# EAGLE design RF Test Board (EAGLE 7.7.0)
BOARD_ID: RF_TEST; HW_REV: 1

## Sheet 1 of 3: 3-Switch Configuration
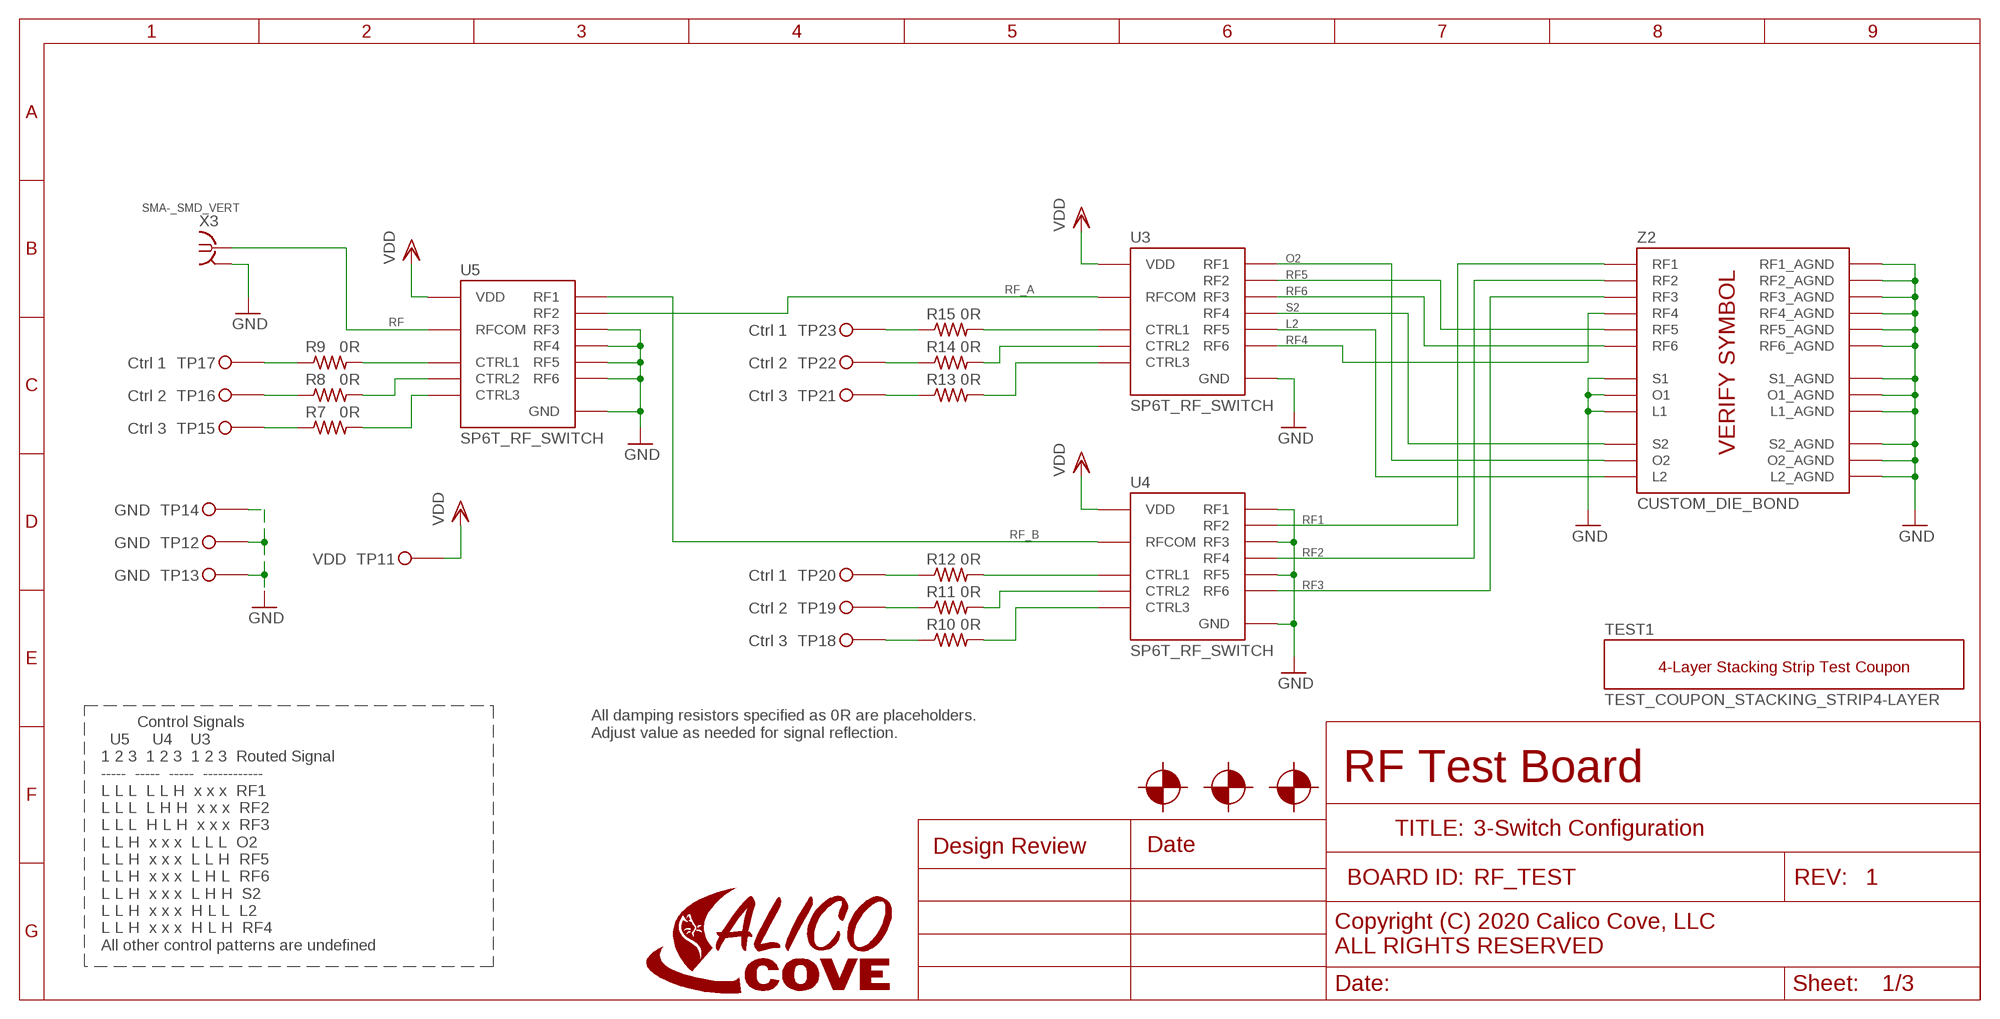
[diagram p0: schematic, sheet 1]

### Parts
DOCBLOCK1  DOCBLOCK_REVIEW_2020  [DOCBLOCK]
FID$1  FIDUCIAL  [FIDUCIAL]
FID$2  FIDUCIAL  [FIDUCIAL]
FID$3  FIDUCIAL  [FIDUCIAL]
LOGO1  LOGO_CC_SMALL  [CC_FULL_SMALL]
R7  0R  RESISTOR0603  [0603]
R8  0R  RESISTOR0603  [0603]
R9  0R  RESISTOR0603  [0603]
R10  0R  RESISTOR0603  [0603]
R11  0R  RESISTOR0603  [0603]
R12  0R  RESISTOR0603  [0603]
R13  0R  RESISTOR0603  [0603]
R14  0R  RESISTOR0603  [0603]
R15  0R  RESISTOR0603  [0603]
TEST1  TEST_COUPON_STACKING_STRIP4-LAYER  [TEST_COUPON_4-LAYER_STACKING_STRIP]
TP11  VDD  TEST_POINT_TH  [TEST_POINT_TH]
TP12  GND  TEST_POINT_TH  [TEST_POINT_TH]
TP13  GND  TEST_POINT_TH  [TEST_POINT_TH]
TP14  GND  TEST_POINT_TH  [TEST_POINT_TH]
TP15  Ctrl 3  TEST_POINT_TH  [TEST_POINT_TH]
TP16  Ctrl 2  TEST_POINT_TH  [TEST_POINT_TH]
TP17  Ctrl 1  TEST_POINT_TH  [TEST_POINT_TH]
TP18  Ctrl 3  TEST_POINT_TH  [TEST_POINT_TH]
TP19  Ctrl 2  TEST_POINT_TH  [TEST_POINT_TH]
TP20  Ctrl 1  TEST_POINT_TH  [TEST_POINT_TH]
TP21  Ctrl 3  TEST_POINT_TH  [TEST_POINT_TH]
TP22  Ctrl 2  TEST_POINT_TH  [TEST_POINT_TH]
TP23  Ctrl 1  TEST_POINT_TH  [TEST_POINT_TH]
U3  SP6T_RF_SWITCH  [MT1817]
U4  SP6T_RF_SWITCH  [MT1817]
U5  SP6T_RF_SWITCH  [MT1817]
X3  SMA-_SMD_VERT  [LINX_SMD]
Z2  CUSTOM_DIE_BOND  [CUSTOM_IC_DIE_BOND]

### Nets
GND: TP12.P$1 TP13.P$1 TP14.P$1 U3.PAD(GND) U3.PAD_VIA(GND) U4.1(RF5) U4.2(RF3) U4.3(RF1) U4.PAD(GND) U4.PAD_VIA(GND) U5.1(RF5) U5.2(RF3) U5.10(RF4) U5.11(RF6) U5.PAD(GND) U5.PAD_VIA(GND) X3.GND1(SHIELD) X3.GND2(SHIELD) Z2.L1 Z2.L1_GND1(L1_AGND) Z2.L1_GND2(L1_AGND) Z2.L2_GND1(L2_AGND) Z2.L2_GND2(L2_AGND) Z2.O1 Z2.O1_GND1(O1_AGND) Z2.O1_GND2(O1_AGND) Z2.O2_GND1(O2_AGND) Z2.O2_GND2(O2_AGND) Z2.RF1_GND1(RF1_AGND) Z2.RF1_GND2(RF1_AGND) Z2.RF2_GND1(RF2_AGND) Z2.RF2_GND2(RF2_AGND) Z2.RF3_GND1(RF3_AGND) Z2.RF3_GND2(RF3_AGND) Z2.RF4_GND1(RF4_AGND) Z2.RF4_GND2(RF4_AGND) Z2.RF5_GND1(RF5_AGND) Z2.RF5_GND2(RF5_AGND) Z2.RF6_GND1(RF6_AGND) Z2.RG6_GND2(RF6_AGND) Z2.S1 Z2.S1_GND1(S1_AGND) Z2.S1_GND2(S1_AGND) Z2.S2_GND1(S2_AGND) Z2.S2_GND2(S2_AGND) ; also sheet 2,3
L2 [RF_50_Ohm_13.3mil]: U3.1(RF5) Z2.L2
N$1: R15.P$1 TP23.P$1
N$2: R14.P$1 TP22.P$1
N$3: R13.P$1 TP21.P$1
N$4: R15.P$2 U3.7(CTRL1)
N$5: R13.P$2 U3.5(CTRL3)
N$6: R14.P$2 U3.6(CTRL2)
N$13: R9.P$1 TP17.P$1
N$14: R8.P$1 TP16.P$1
N$15: R7.P$1 TP15.P$1
N$16: R12.P$1 TP20.P$1
N$17: R11.P$1 TP19.P$1
N$18: R10.P$1 TP18.P$1
N$19: R9.P$2 U5.7(CTRL1)
N$20: R8.P$2 U5.6(CTRL2)
N$21: R7.P$2 U5.5(CTRL3)
N$22: R12.P$2 U4.7(CTRL1)
N$23: R10.P$2 U4.5(CTRL3)
N$24: R11.P$2 U4.6(CTRL2)
O2 [RF_50_Ohm_13.3mil]: U3.3(RF1) Z2.O2
RF [RF_50_Ohm_13.3mil]: U5.13(RFCOM) X3.1
RF1 [RF_50_Ohm_13.3mil]: U4.9(RF2) Z2.RF1
RF2 [RF_50_Ohm_13.3mil]: U4.10(RF4) Z2.RF2
RF3 [RF_50_Ohm_13.3mil]: U4.11(RF6) Z2.RF3
RF4 [RF_50_Ohm_13.3mil]: U3.11(RF6) Z2.RF4
RF5 [RF_50_Ohm_13.3mil]: U3.9(RF2) Z2.RF5
RF6 [RF_50_Ohm_13.3mil]: U3.2(RF3) Z2.RF6
RF_A [RF_50_Ohm_13.3mil]: U3.13(RFCOM) U5.9(RF2)
RF_B [RF_50_Ohm_13.3mil]: U4.13(RFCOM) U5.3(RF1)
S2 [RF_50_Ohm_13.3mil]: U3.10(RF4) Z2.S2
VDD [Power]: TP11.P$1 U3.4(VDD) U4.4(VDD) U5.4(VDD)

### Notes on the sheet
- All damping resistors specified as 0R are placeholders.
  Adjust value as needed for signal reflection.
- 3-Switch Configuration
- Control Signals
    U5     U4    U3
  1 2 3  1 2 3  1 2 3  Routed Signal
  -----  -----  -----  ------------
  L L L  L L H  x x x  RF1
  L L L  L H H  x x x  RF2
  L L L  H L H  x x x  RF3
  L L H  x x x  L L L  O2
  L L H  x x x  L L H  RF5
  L L H  x x x  L H L  RF6
  L L H  x x x  L H H  S2
  L L H  x x x  H L L  L2
  L L H  x x x  H L H  RF4
  All other control patterns are undefined

## Sheet 2 of 3: 2-Switch Configuration
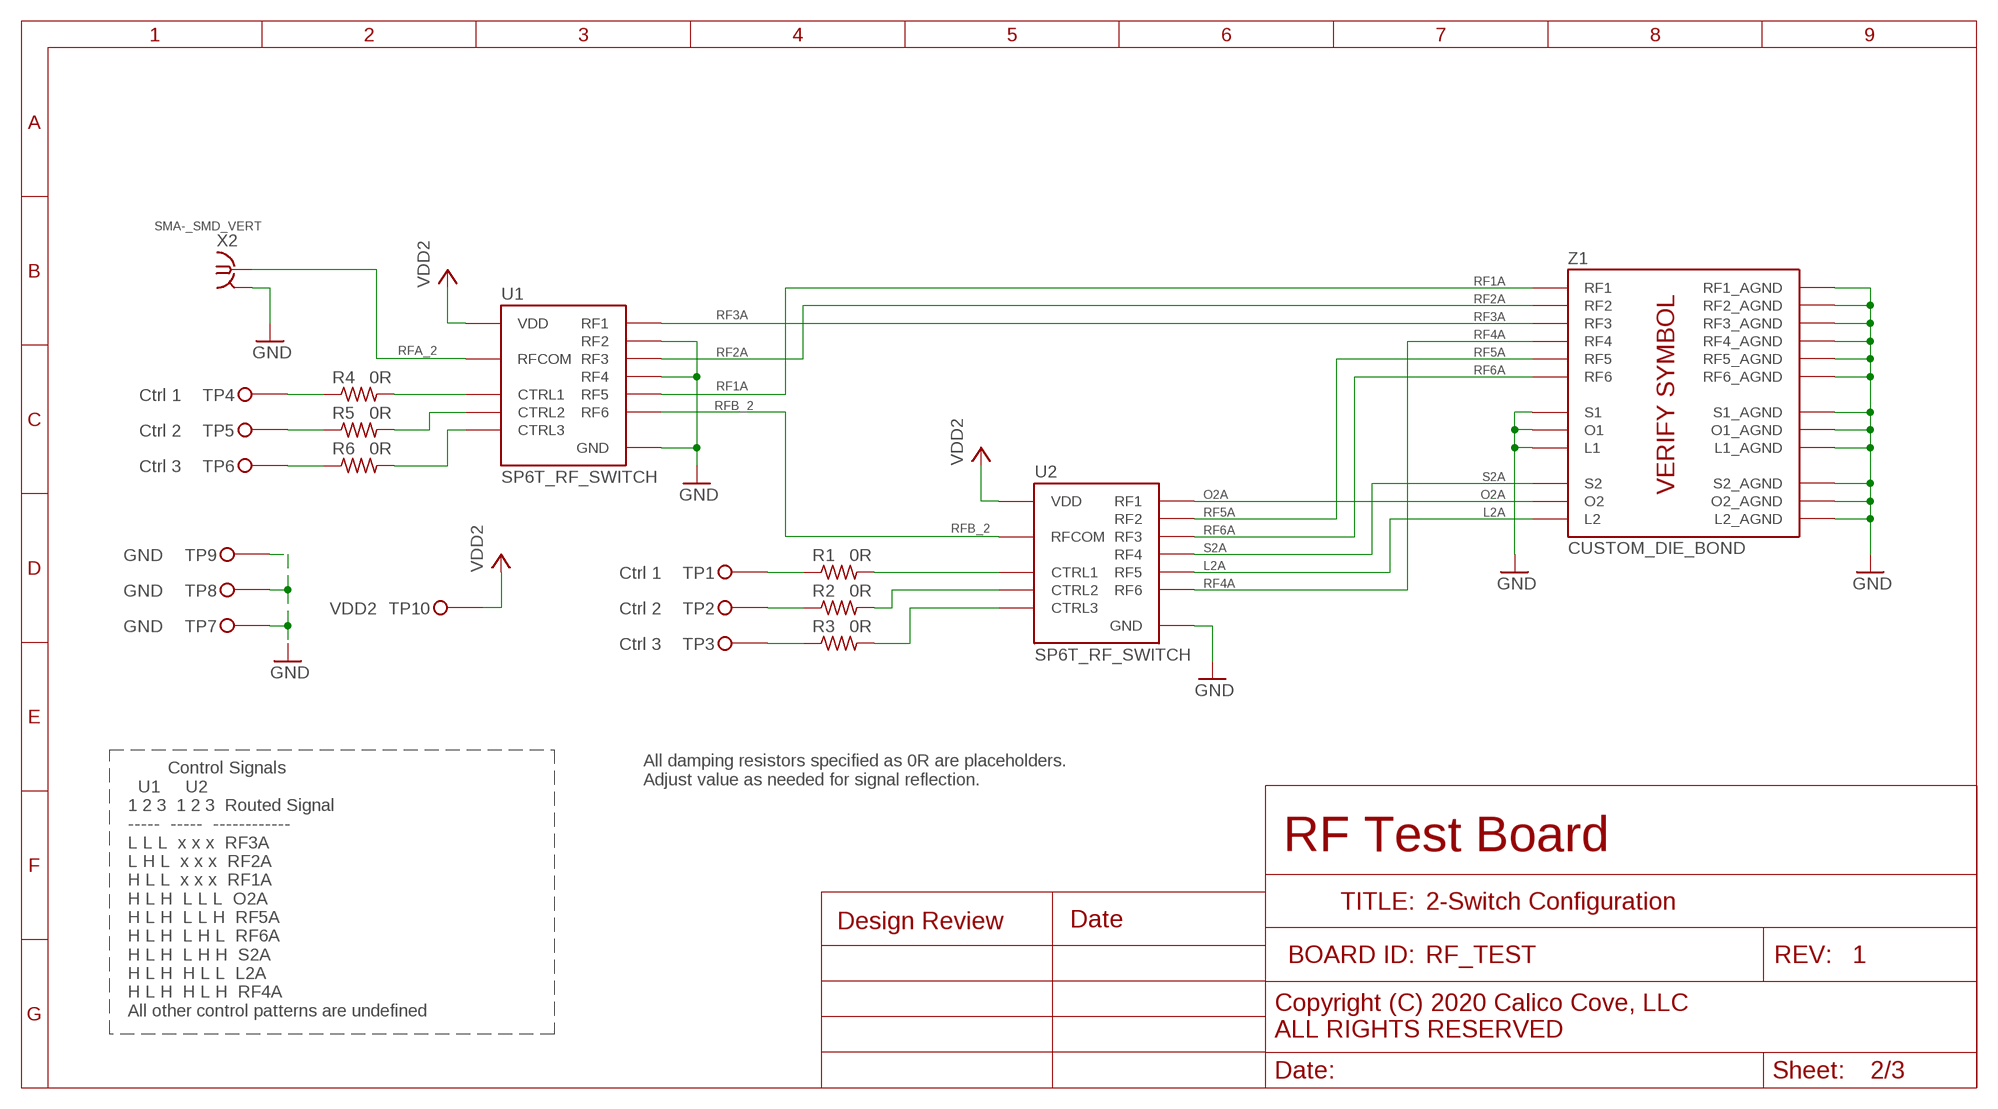
[diagram p1: schematic, sheet 2]

### Parts
R1  0R  RESISTOR0603  [0603]
R2  0R  RESISTOR0603  [0603]
R3  0R  RESISTOR0603  [0603]
R4  0R  RESISTOR0603  [0603]
R5  0R  RESISTOR0603  [0603]
R6  0R  RESISTOR0603  [0603]
TP1  Ctrl 1  TEST_POINT_TH  [TEST_POINT_TH]
TP2  Ctrl 2  TEST_POINT_TH  [TEST_POINT_TH]
TP3  Ctrl 3  TEST_POINT_TH  [TEST_POINT_TH]
TP4  Ctrl 1  TEST_POINT_TH  [TEST_POINT_TH]
TP5  Ctrl 2  TEST_POINT_TH  [TEST_POINT_TH]
TP6  Ctrl 3  TEST_POINT_TH  [TEST_POINT_TH]
TP7  GND  TEST_POINT_TH  [TEST_POINT_TH]
TP8  GND  TEST_POINT_TH  [TEST_POINT_TH]
TP9  GND  TEST_POINT_TH  [TEST_POINT_TH]
TP10  VDD2  TEST_POINT_TH  [TEST_POINT_TH]
U1  SP6T_RF_SWITCH  [MT1817]
U2  SP6T_RF_SWITCH  [MT1817]
X2  SMA-_SMD_VERT  [LINX_SMD]
Z1  CUSTOM_DIE_BOND  [CUSTOM_IC_DIE_BOND]

### Nets
GND: TP7.P$1 TP8.P$1 TP9.P$1 U1.9(RF2) U1.10(RF4) U1.PAD(GND) U1.PAD_VIA(GND) U2.PAD(GND) U2.PAD_VIA(GND) X2.GND1(SHIELD) X2.GND2(SHIELD) Z1.L1 Z1.L1_GND1(L1_AGND) Z1.L1_GND2(L1_AGND) Z1.L2_GND1(L2_AGND) Z1.L2_GND2(L2_AGND) Z1.O1 Z1.O1_GND1(O1_AGND) Z1.O1_GND2(O1_AGND) Z1.O2_GND1(O2_AGND) Z1.O2_GND2(O2_AGND) Z1.RF1_GND1(RF1_AGND) Z1.RF1_GND2(RF1_AGND) Z1.RF2_GND1(RF2_AGND) Z1.RF2_GND2(RF2_AGND) Z1.RF3_GND1(RF3_AGND) Z1.RF3_GND2(RF3_AGND) Z1.RF4_GND1(RF4_AGND) Z1.RF4_GND2(RF4_AGND) Z1.RF5_GND1(RF5_AGND) Z1.RF5_GND2(RF5_AGND) Z1.RF6_GND1(RF6_AGND) Z1.RG6_GND2(RF6_AGND) Z1.S1 Z1.S1_GND1(S1_AGND) Z1.S1_GND2(S1_AGND) Z1.S2_GND1(S2_AGND) Z1.S2_GND2(S2_AGND) ; also sheet 1,3
L2A [RF_50_Ohm_13.3mil]: U2.1(RF5) Z1.L2
N$7: R4.P$1 TP4.P$1
N$9: R5.P$1 TP5.P$1
N$10: R6.P$1 TP6.P$1
N$11: R1.P$1 TP1.P$1
N$12: R2.P$1 TP2.P$1
N$25: R3.P$1 TP3.P$1
N$26: R4.P$2 U1.7(CTRL1)
N$27: R5.P$2 U1.6(CTRL2)
N$28: R6.P$2 U1.5(CTRL3)
N$29: R1.P$2 U2.7(CTRL1)
N$30: R3.P$2 U2.5(CTRL3)
N$31: R2.P$2 U2.6(CTRL2)
O2A [RF_50_Ohm_13.3mil]: U2.3(RF1) Z1.O2
RF1A [RF_50_Ohm_13.3mil]: U1.1(RF5) Z1.RF1
RF2A [RF_50_Ohm_13.3mil]: U1.2(RF3) Z1.RF2
RF3A [RF_50_Ohm_13.3mil]: U1.3(RF1) Z1.RF3
RF4A [RF_50_Ohm_13.3mil]: U2.11(RF6) Z1.RF4
RF5A [RF_50_Ohm_13.3mil]: U2.9(RF2) Z1.RF5
RF6A [RF_50_Ohm_13.3mil]: U2.2(RF3) Z1.RF6
RFA_2 [RF_50_Ohm_13.3mil]: U1.13(RFCOM) X2.1
RFB_2 [RF_50_Ohm_13.3mil]: U1.11(RF6) U2.13(RFCOM)
S2A [RF_50_Ohm_13.3mil]: U2.10(RF4) Z1.S2
VDD2: TP10.P$1 U1.4(VDD) U2.4(VDD)

### Notes on the sheet
- All damping resistors specified as 0R are placeholders.
  Adjust value as needed for signal reflection.
- 2-Switch Configuration
- Control Signals
    U1     U2
  1 2 3  1 2 3  Routed Signal
  -----  -----  ------------
  L L L  x x x  RF3A
  L H L  x x x  RF2A
  H L L  x x x  RF1A
  H L H  L L L  O2A  
  H L H  L L H  RF5A
  H L H  L H L  RF6A
  H L H  L H H  S2A
  H L H  H L L  L2A
  H L H  H L H  RF4A
  All other control patterns are undefined

## Sheet 3 of 3: Test Coupon
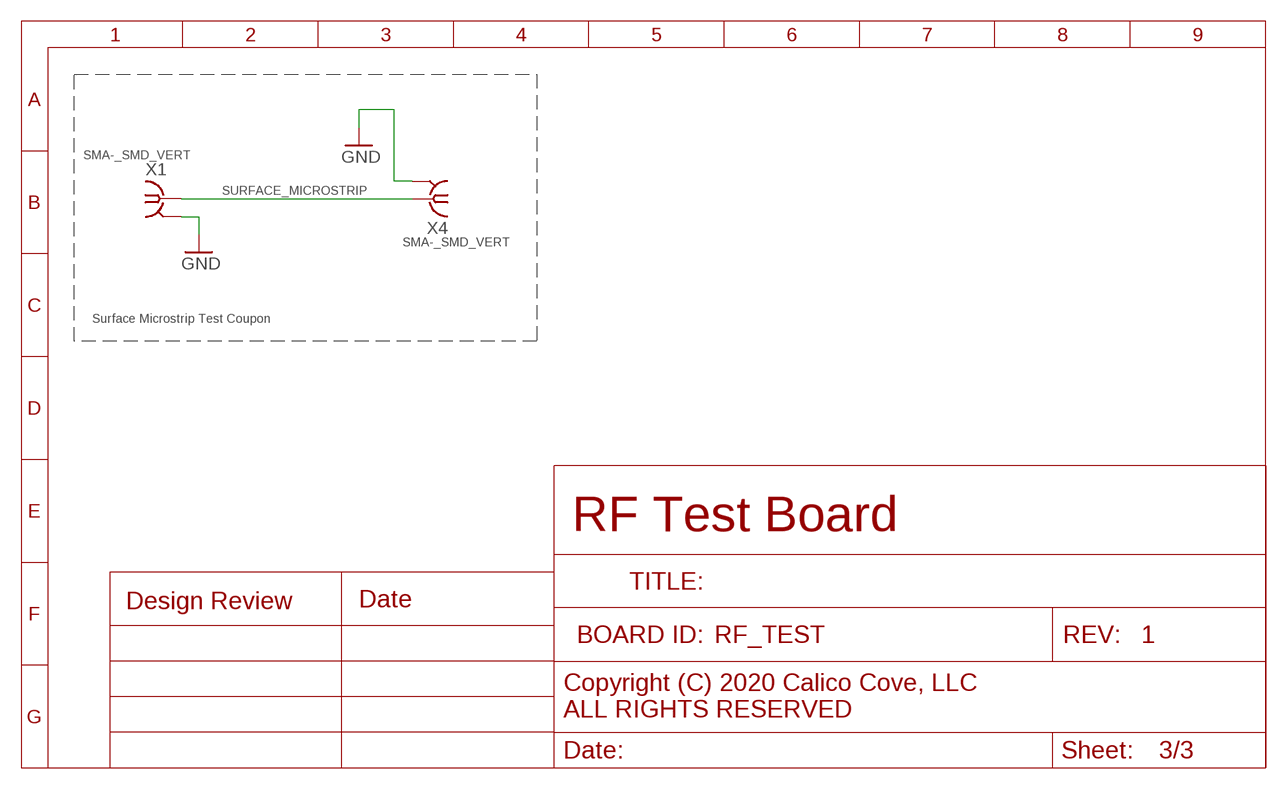
[diagram p2: schematic, sheet 3]

### Parts
X1  SMA-_SMD_VERT  [LINX_SMD]
X4  SMA-_SMD_VERT  [LINX_SMD]

### Nets
GND: X1.GND1(SHIELD) X1.GND2(SHIELD) X4.GND1(SHIELD) X4.GND2(SHIELD) ; also sheet 1,2
SURFACE_MICROSTRIP [RF_50_Ohm_13.3mil]: X1.1 X4.1

### Notes on the sheet
- Surface Microstrip Test Coupon

## Library data of the parts
DOCBLOCK1 = CalicoCove:DOCBLOCK_REVIEW_2020
FID$1-FID$3 = CalicoCove:FIDUCIAL: Fiducial mark on both top and bottom layers
LOGO1 = CalicoCove:LOGO_CC: Various Calico Cove Logos
R1-R15 = Passives:RESISTOR: Resistors; SIZE: 0603
TEST1 = CalicoCove:TEST_COUPON_STACKING_STRIP: Test Coupon for Multilayer Stackup Strips of copper are plotted along one edge of a PCB in such a way that when the PCB is cut from the panel the strips are visible to the naked eye. The strip in each layer gets longer than the one above. This stair step makes it possible to determine that all the layers are in the correct order by simply observing that the stair steps get longer with each layer down into the PCB. It is also possible to examine the overall cross section of the PCB by measuring the thickness of the dielectric layers and the copper layers. This provides a complete audit of the stackup without the need for destructive testing. These features are a part of every PCB, so it is easy to check the cross section and impedance long after the PCB has been assembled, should this be necessary. Ref http://speedingedge.com/PDF-Files/Test Structures.pdf <http://speedingedge.com/PDF-Files/Test%20Structures.pdf>
TP1-TP23 = CalicoCove:TEST_POINT
U1-U5 = RF:SP6T_RF_SWITCH: SP6T RF Switch Reflective RF Switch with internal driver JSW6-33DR+ is a high power 3W reflective SPDT switch with integral driver, operates with single positive supply voltage while consuming, 40 μA typical. It has been designed for very wideband operation of 5-2700 MHz. It is packaged in a tiny 14-lead 2mm x 2mm x 0.55mm package and is rated MSL1 and class 1B ESD.
X1-X4 = RF:SMA-: SMA 50 Ohm Receptacle; DIGIKEY: CONSMA001-SMD-G-ND; MFG: Linx Technologies, Inc.; MPN: CONSMA001-SMD-G
Z1 Z2 = RF:CUSTOM_DIE: Custom DIE Actual Footprint TBD

## Net classes
1 RF_50_Ohm_13.3mil: width 0.338 mm, clearance 0.203 mm

## Board
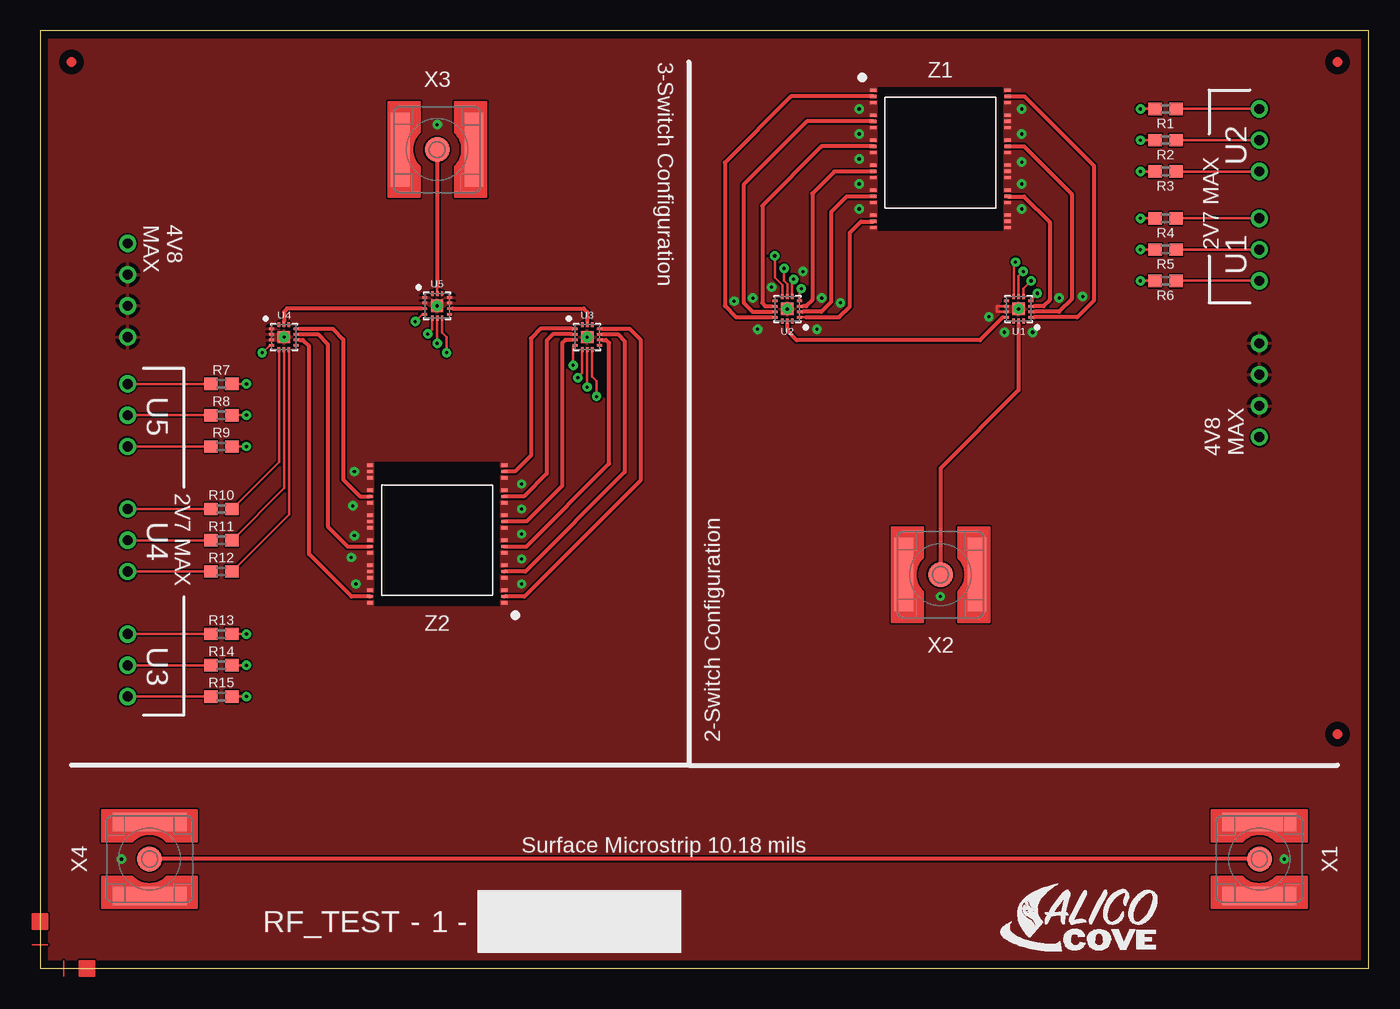
[diagram p3: board, top side]
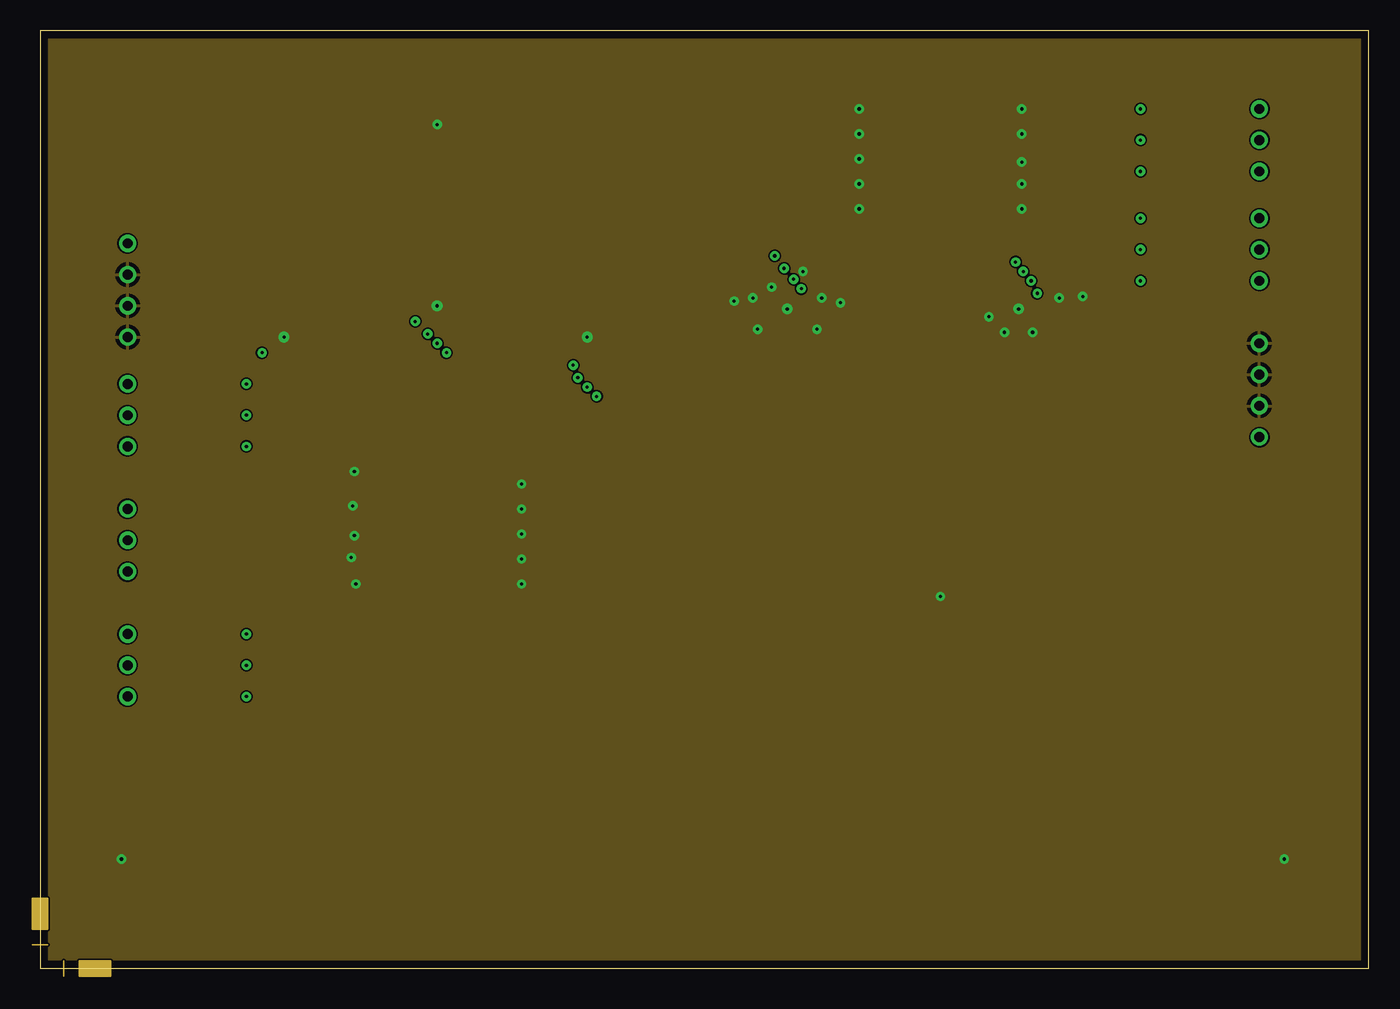
[diagram p4: board, inner layer RF_GND]
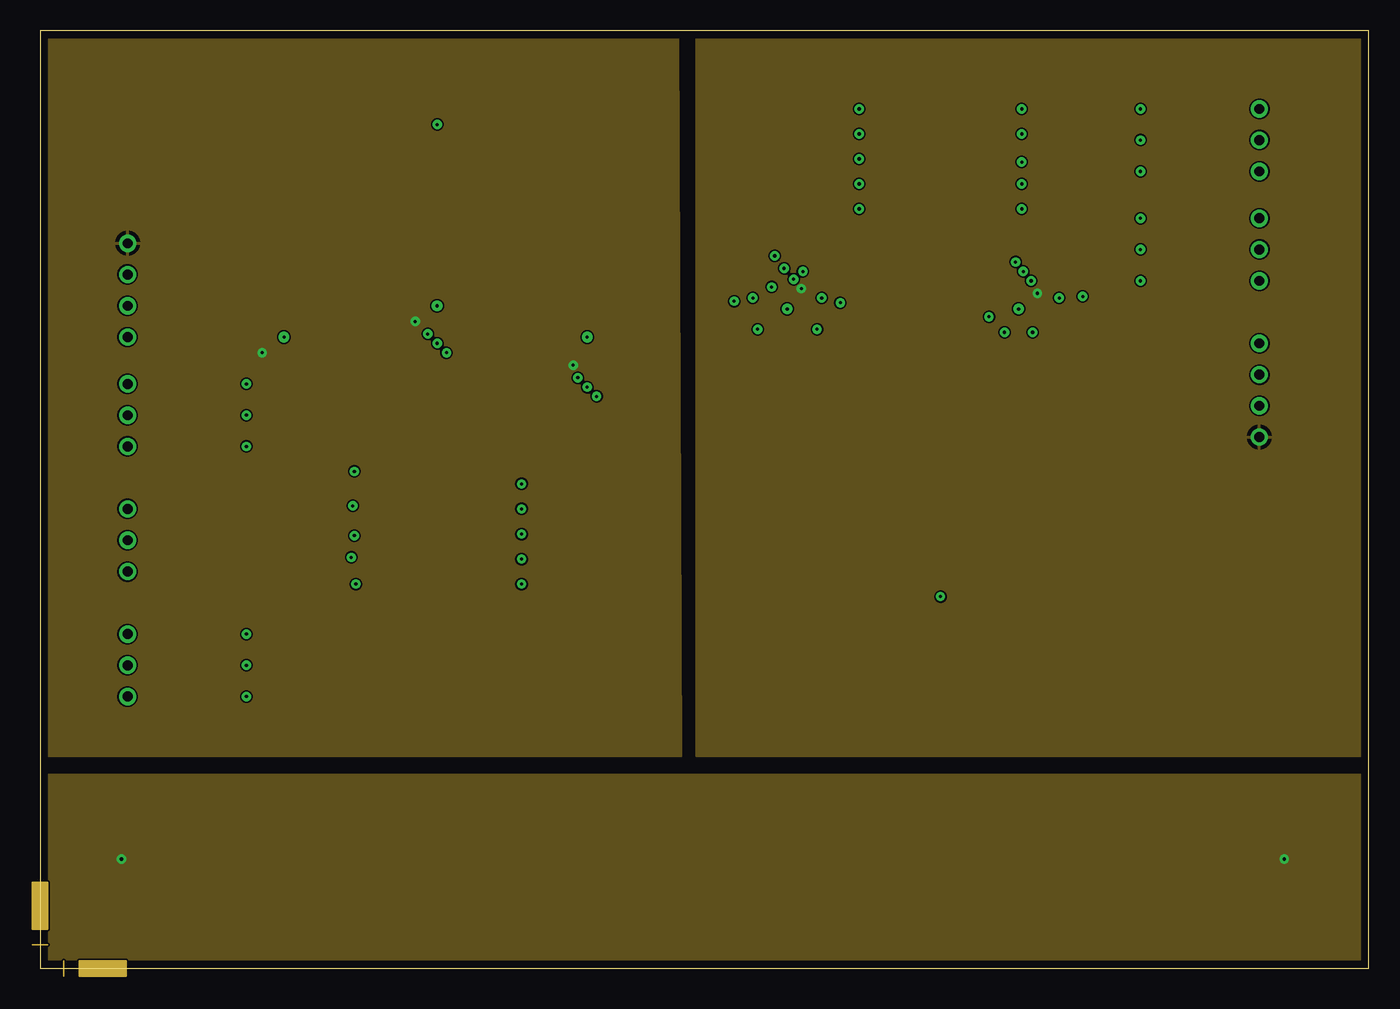
[diagram p5: board, inner layer Power]
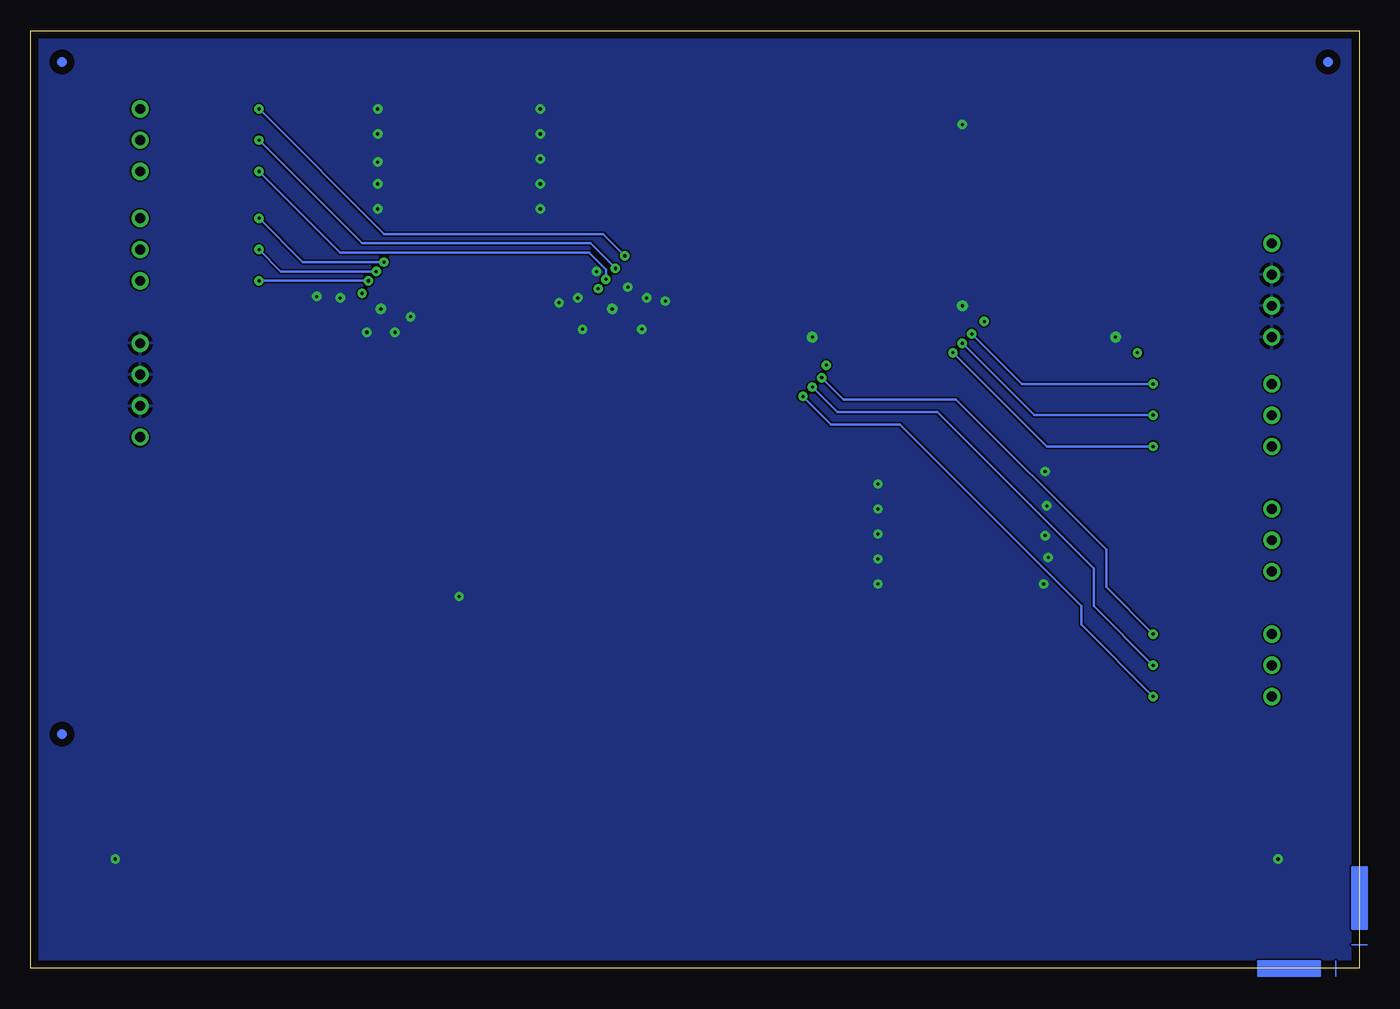
[diagram p6: board, bottom side, seen from below]

Size 107.95 x 76.2 mm. Coordinates in mm from the lower left corner, seen from the top.
Outline: 0,76.2 0,0 107.95,0 107.95,76.2 0,76.2
Copper layers (1*2*15*16): Top 0.053340625mm / dielectric 7.5mil / RF_GND 0.035559375mm / dielectric 40mil / Power 0.035559375mm / dielectric 7.5mil / Bottom 0.053340625mm
Design rules "BAC 4 Layer": minimum track width 5mil, minimum drill 10mil, track to track 5mil, track to pad 7mil, pad to pad 6mil, via to via 6mil, smd to smd 6mil, copper to edge 25mil, drill to drill 15mil, minimum pad ring 12mil, minimum via ring 10mil, stop-mask expansion 3mil, vias tented up to drill 15mil, thermal gap 12mil

### Footprints (pad centres in the part's own frame; a part is rotated, then mirrored left to right if it is on the bottom)
0603 = smd 1.1 x 1: P$1 -0.85,0; P$2 0.85,0
TEST_POINT_TH = drill 0.8: P$1 0,0
MT1817 = smd 0.4 x 0.2: 1 -1,0.675; 2 -1,0.225; 3 -1,-0.225; 4 -1,-0.675; 8 1,-0.675; 9 1,-0.225; 10 1,0.225; 11 1,0.675 | smd 0.2 x 0.4: 5 -0.4,-1; 6 0,-1; 7 0.4,-1; 12 0.4,1; 13 0,1; 14 -0.4,1 | smd 1 x 1: PAD 0,0 | drill 0.254: PAD_VIA 0,0
LINX_SMD = smd 2.05 x 2.05: 1 0,0 | smd 1.5 x 6: GND1 -3,0; GND2 3,0
CUSTOM_IC_DIE_BOND = smd 0.5 x 0.259: L1 5.461,-5.588; L1_GND1 5.461,-6.096; L1_GND2 5.461,-5.08; L2 -5.461,-5.588; L2_GND1 -5.461,-5.08; L2_GND2 -5.461,-6.096; O1 5.461,-1.524; O1_GND1 5.461,-2.032; O1_GND2 5.461,-1.016; O2 -5.461,-1.524; O2_GND1 -5.461,-1.016; O2_GND2 -5.461,-2.032; RF1 5.461,4.572; RF1_GND1 5.461,4.064; RF1_GND2 5.461,5.08; RF2 5.461,0.508; RF2_GND1 5.461,0; RF2_GND2 5.461,1.016; RF3 5.461,-3.556; RF3_GND1 5.461,-4.064; RF3_GND2 5.461,-3.048; RF4 -5.461,4.572; RF4_GND1 -5.461,5.08; RF4_GND2 -5.461,4.064; RF5 -5.461,0.508; RF5_GND1 -5.461,1.016; RF5_GND2 -5.461,0; RF6 -5.461,-3.556; RF6_GND1 -5.461,-3.048; RG6_GND2 -5.461,-4.064; S1 5.461,2.54; S1_GND1 5.461,2.032; S1_GND2 5.461,3.048; S2 -5.461,2.54; S2_GND1 -5.461,3.048; S2_GND2 -5.461,2.032

### Placement (x,y rotation side)
DOCBLOCK1  30.48,3.81 0 top
FID$1  105.41,73.66 270 top
FID$2  105.41,19.05 270 top
FID$3  2.54,73.66 270 top
LOGO1  85.34,3.81 0 top
R1  91.44,69.85 180 top
R2  91.44,67.31 180 top
R3  91.44,64.77 180 top
R4  91.44,60.96 180 top
R5  91.44,58.42 180 top
R6  91.44,55.88 180 top
R7  14.73,47.5 0 top
R8  14.73,44.96 0 top
R9  14.73,42.42 0 top
R10  14.73,37.34 0 top
R11  14.73,34.8 0 top
R12  14.73,32.26 0 top
R13  14.73,27.18 0 top
R14  14.73,24.64 0 top
R15  14.73,22.1 0 top
TEST1  0,0 0 top
TP1  99.06,69.85 0 top
TP2  99.06,67.31 0 top
TP3  99.06,64.77 0 top
TP4  99.06,60.96 0 top
TP5  99.06,58.42 0 top
TP6  99.06,55.88 0 top
TP7  99.06,50.8 0 top
TP8  99.06,48.26 0 top
TP9  99.06,45.72 0 top
TP10  99.06,43.18 0 top
TP11  7.11,58.93 0 top
TP12  7.11,56.39 0 top
TP13  7.11,53.85 0 top
TP14  7.11,51.31 0 top
TP15  7.11,47.5 180 top
TP16  7.11,44.96 180 top
TP17  7.11,42.42 180 top
TP18  7.11,37.34 0 top
TP19  7.11,34.8 0 top
TP20  7.11,32.26 0 top
TP21  7.11,27.18 180 top
TP22  7.11,24.64 0 top
TP23  7.11,22.1 0 top
U1  79.5,53.59 180 top
U2  60.71,53.59 180 top
U3  44.45,51.31 0 top
U4  19.81,51.31 0 top
U5  32.26,53.85 0 top
X1  99.06,8.89 270 top
X2  73.15,32 180 top
X3  32.26,66.55 0 top
X4  8.89,8.89 90 top
Z1  73.15,66.29 0 top
Z2  32.26,34.8 180 top

### Tracks (layer width: path | path; a pad name or v marks a point on that pad's centre or on a via)
GND  (via drill 0.25)
  Top 0.203: U1.10 77.72,53.37 77.72,53.82 78.49,53.82
  other vias: 39.12,39.37 39.12,37.34 39.12,35.31 39.12,33.27 39.12,31.24 25.53,40.39 25.4,37.59 25.53,35.18 25.27,33.4 25.65,31.24 6.6,8.89 101.09,8.89 66.55,61.72 66.55,63.75 66.55,65.79 66.55,67.82 66.55,69.85 79.76,69.85 79.76,67.82 79.76,65.53 79.76,63.75 79.76,61.72 32.26,68.58 73.15,30.23 65.02,54.1 63.5,54.48 57.91,54.48 56.39,54.23 58.29,51.94 63.12,51.94 77.09,52.96 78.36,51.69 80.64,51.69 84.71,54.61 82.8,54.48 61.98,56.64 59.44,55.37
  pour Top (rank 6): 0,76.2 107.95,76.2 107.95,0 0,0
  pour Top (no thermals): 38.35,41.66 26.16,41.66 26.16,28.96 38.35,28.96
  pour Bottom (rank 6): 0,76.2 107.95,76.2 107.95,0 0,0
  pour RF_GND (rank 6): 0,0 0,76.2 107.95,76.2 107.95,0
  pour Top (no thermals): 79.25,72.14 67.06,72.14 67.06,59.44 79.25,59.44
  pour Power: 0,0 0,15.75 107.95,15.75 107.95,0
L2
  Top 0.203: U3.1 43.22,51.98
  Top 0.338: Z2.L2 38.58,40.39 39.88,41.68 39.88,51.2 40.66,51.98 43.22,51.98
L2A
  Top 0.203: U2.1 62.23,52.92
  Top 0.338: Z1.L2 66.7,60.71 65.79,59.79 65.79,53.79 64.92,52.92 62.23,52.92
N$1
  Top 0.203: TP23.P$1 R15.P$1
N$2
  Top 0.203: TP22.P$1 R14.P$1
N$3
  Top 0.203: TP21.P$1 R13.P$1
N$4  (via drill 0.25)
  Top 0.203: U3.7 44.85,48.11 45.21,47.75 v45.21,46.48 | R15.P$2 v16.76,22.1
  Bottom 0.203: v45.21,46.48 42.93,44.2 37.34,44.2 22.61,29.46 22.61,27.94 v16.76,22.1
N$5  (via drill 0.25)
  Top 0.203: U3.5 44.05,48.37 v43.69,48.01 | R13.P$2 v16.76,27.18
  Bottom 0.203: v43.69,48.01 41.91,46.23 32.77,46.23 20.57,34.04 20.57,30.99 v16.76,27.18
N$6  (via drill 0.25)
  Top 0.203: U3.6 v44.45,47.24 | R14.P$2 v16.76,24.64
  Bottom 0.203: v44.45,47.24 42.42,45.21 34.29,45.21 21.59,32.51 21.59,29.46 v16.76,24.64
N$7
  Top 0.203: R4.P$1 TP4.P$1
N$9
  Top 0.203: R5.P$1 TP5.P$1
N$10
  Top 0.203: R6.P$1 TP6.P$1
N$11
  Top 0.203: R1.P$1 TP1.P$1
N$12
  Top 0.203: R2.P$1 TP2.P$1
N$13
  Top 0.203: TP17.P$1 R9.P$1
N$14
  Top 0.203: TP16.P$1 R8.P$1
N$15
  Top 0.203: TP15.P$1 R7.P$1
N$16
  Top 0.203: TP20.P$1 R12.P$1
N$17
  Top 0.203: TP19.P$1 R11.P$1
N$18
  Top 0.203: TP18.P$1 R10.P$1
N$19  (via drill 0.25)
  Top 0.203: U5.7 32.66,51.67 33.02,51.31 v33.02,50.04 | v16.76,42.42 R9.P$2
  Bottom 0.203: v16.76,42.42 25.4,42.42 v33.02,50.04
N$20  (via drill 0.25)
  Top 0.203: U5.6 v32.26,50.8 | v16.76,44.96 R8.P$2
  Bottom 0.203: v32.26,50.8 26.42,44.96 v16.76,44.96
N$21  (via drill 0.25)
  Top 0.203: U5.5 31.86,51.92 v31.5,51.56 | v16.76,47.5 R7.P$2
  Bottom 0.203: v31.5,51.56 27.43,47.5 v16.76,47.5
N$22
  Top 0.203: R12.P$2 20.21,36.89 U4.7
N$23
  Top 0.203: R10.P$2 19.41,41.17 U4.5
N$24
  Top 0.203: R11.P$2 19.81,39.03 U4.6
N$25
  Top 0.203: R3.P$1 TP3.P$1
N$26  (via drill 0.25)
  Top 0.203: U1.7 79.1,57.26 v79.25,57.4 | R4.P$2 v89.41,60.96
  Bottom 0.203: v79.25,57.4 85.85,57.4 v89.41,60.96
N$27  (via drill 0.25)
  Top 0.203: U1.6 79.5,56.26 v79.88,56.64 | R5.P$2 v89.41,58.42
  Bottom 0.203: v79.88,56.64 85.34,56.64 86.61,56.64 87.63,56.64 v89.41,58.42
N$28  (via drill 0.25)
  Top 0.203: U1.5 79.9,55.26 v80.52,55.88 | R6.P$2 v89.41,55.88
  Bottom 0.203: v80.52,55.88 86.36,55.88 86.87,55.88 v89.41,55.88
N$29  (via drill 0.25)
  Top 0.203: U2.7 60.31,55.52 59.69,56.13 v59.69,57.91 | R1.P$2 v89.41,69.85
  Bottom 0.203: v59.69,57.91 61.47,59.69 79.25,59.69 v89.41,69.85
N$30  (via drill 0.25)
  Top 0.203: U2.5 61.11,55.9 v61.21,56.01 | R3.P$2 v89.41,64.77
  Bottom 0.203: v61.21,56.01 61.21,56.8 62.58,58.17 82.8,58.17 v89.41,64.77
N$31  (via drill 0.25)
  Top 0.203: U2.6 60.71,55.63 60.45,55.88 v60.45,56.9 | R2.P$2 v89.41,67.31
  Bottom 0.203: v60.45,56.9 62.48,58.93 81.03,58.93 v89.41,67.31
O2
  Top 0.203: U3.3 43.21,51.08
  Top 0.338: Z2.O2 39.52,36.32 42.42,39.22 42.42,50.83 42.67,51.08 43.21,51.08
O2A
  Top 0.203: U2.3 61.98,53.82
  Top 0.338: Z1.O2 64.53,64.77 62.74,62.97 62.74,54.33 62.23,53.82 61.98,53.82
RF
  Top 0.203: U5.13 32.26,55.37
  Top 0.338: X3.1 32.26,55.37
RF1
  Top 0.203: U4.9 21.08,51.08
  Top 0.338: Z2.RF1 25.3,30.23 21.84,33.68 21.84,50.57 21.34,51.08 21.08,51.08
RF1A
  Top 0.203: U1.1 80.77,52.92
  Top 0.338: Z1.RF1 79.97,70.87 85.6,65.24 85.6,54.26 84.26,52.92 80.77,52.92
RF2
  Top 0.203: U4.10 21.08,51.53
  Top 0.338: Z2.RF2 24.99,34.29 23.37,35.92 23.37,50.74 22.57,51.53 21.08,51.53
RF2A
  Top 0.203: U1.2 80.77,53.37
  Top 0.338: Z1.RF2 79.94,66.8 83.82,62.92 83.82,54.41 82.78,53.37 80.77,53.37
RF3
  Top 0.203: U4.11 21.08,51.98
  Top 0.338: Z2.RF3 26.01,38.35 24.64,39.72 24.64,51.11 23.77,51.98 21.08,51.98
RF3A
  Top 0.203: U1.3 80.77,53.82
  Top 0.338: Z1.RF3 79.95,62.74 82.04,60.64 82.04,54.33 81.53,53.82 80.77,53.82
RF4
  Top 0.203: U3.11 45.69,51.98
  Top 0.338: Z2.RF4 39.34,30.23 48.77,39.65 48.77,51.11 47.9,51.98 45.69,51.98
RF4A
  Top 0.203: U2.11 59.44,52.92
  Top 0.338: Z1.RF4 61.01,70.87 55.63,65.48 55.63,53.85 56.55,52.92 59.44,52.92
RF5
  Top 0.203: U3.9 45.69,51.08
  Top 0.338: Z2.RF5 39.5,34.29 46.23,41.02 46.23,50.83 45.97,51.08 45.69,51.08
RF5A
  Top 0.203: U2.9 59.44,53.82
  Top 0.338: Z1.RF5 63.49,66.8 58.67,61.98 58.67,54.08 58.93,53.82 59.44,53.82
RF6
  Top 0.203: U3.2 43.21,51.53
  Top 0.338: Z2.RF6 39.3,38.35 41.15,40.2 41.15,51.02 41.66,51.53 43.21,51.53
RF6A
  Top 0.203: U2.2 61.98,53.37
  Top 0.338: Z1.RF6 65.53,62.74 64.26,61.47 64.26,54.16 63.47,53.37 61.98,53.37
RF_A
  Top 0.203: U3.13 44.45,52.58 | U5.9 33.53,53.62
  Top 0.338: 33.53,53.62 44.17,53.62 44.45,53.34 44.45,52.58
RF_B
  Top 0.203: U4.13 19.81,52.58 | U5.3 30.99,53.62
  Top 0.338: 30.99,53.62 20.06,53.62 19.81,53.38 19.81,52.58
RFA_2
  Top 0.203: U1.13 79.5,52.32
  Top 0.338: 79.5,52.32 79.5,46.99 73.15,40.64 X2.1
RFB_2
  Top 0.203: U2.13 60.71,52.32 | U1.11 78.23,52.92
  Top 0.338: 78.23,52.92 76.37,51.05 61.47,51.05 60.71,51.82 60.71,52.32
S2
  Top 0.203: U3.10 45.69,51.53
  Top 0.338: Z2.S2 39.43,32.26 47.5,40.33 47.5,50.98 46.94,51.53 45.69,51.53
S2A
  Top 0.203: U2.10 59.44,53.37
  Top 0.338: Z1.S2 62.29,68.83 57.15,63.69 57.15,54.1 57.88,53.37 59.44,53.37
SURFACE_MICROSTRIP
  Top 0.338: X1.1 X4.1
VDD  (via drill 0.25)
  Top 0.203: U5.4 31.07,53.17 v30.48,52.58 | 43.43,50.63 U3.4 43.31,50.49 v43.31,49.02 | U4.4 18.63,50.63 v18.03,50.04
  pour Power (rank 6): 0,17.27 0,76.2 51.82,76.2 52.07,17.27
VDD2  (via drill 0.25)
  Top 0.203: U1.4 81.03,54.79 v81.03,54.86 | U2.4 61.71,55.1 v61.85,55.24
  pour Power (rank 6): 53.34,17.27 53.34,76.2 107.95,76.2 107.95,17.27

### Text on the board
tPlace: 3-Switch Configuration | 2-Switch Configuration | Surface Microstrip 10.18 mils
tNames: U2 | 4V8 / MAX | 2V7 MAX | U1 | U5 | 4V8 / MAX | 2V7 MAX | U4 | U3